# EAGLE design WeatherBoard (EAGLE 9.6.2)
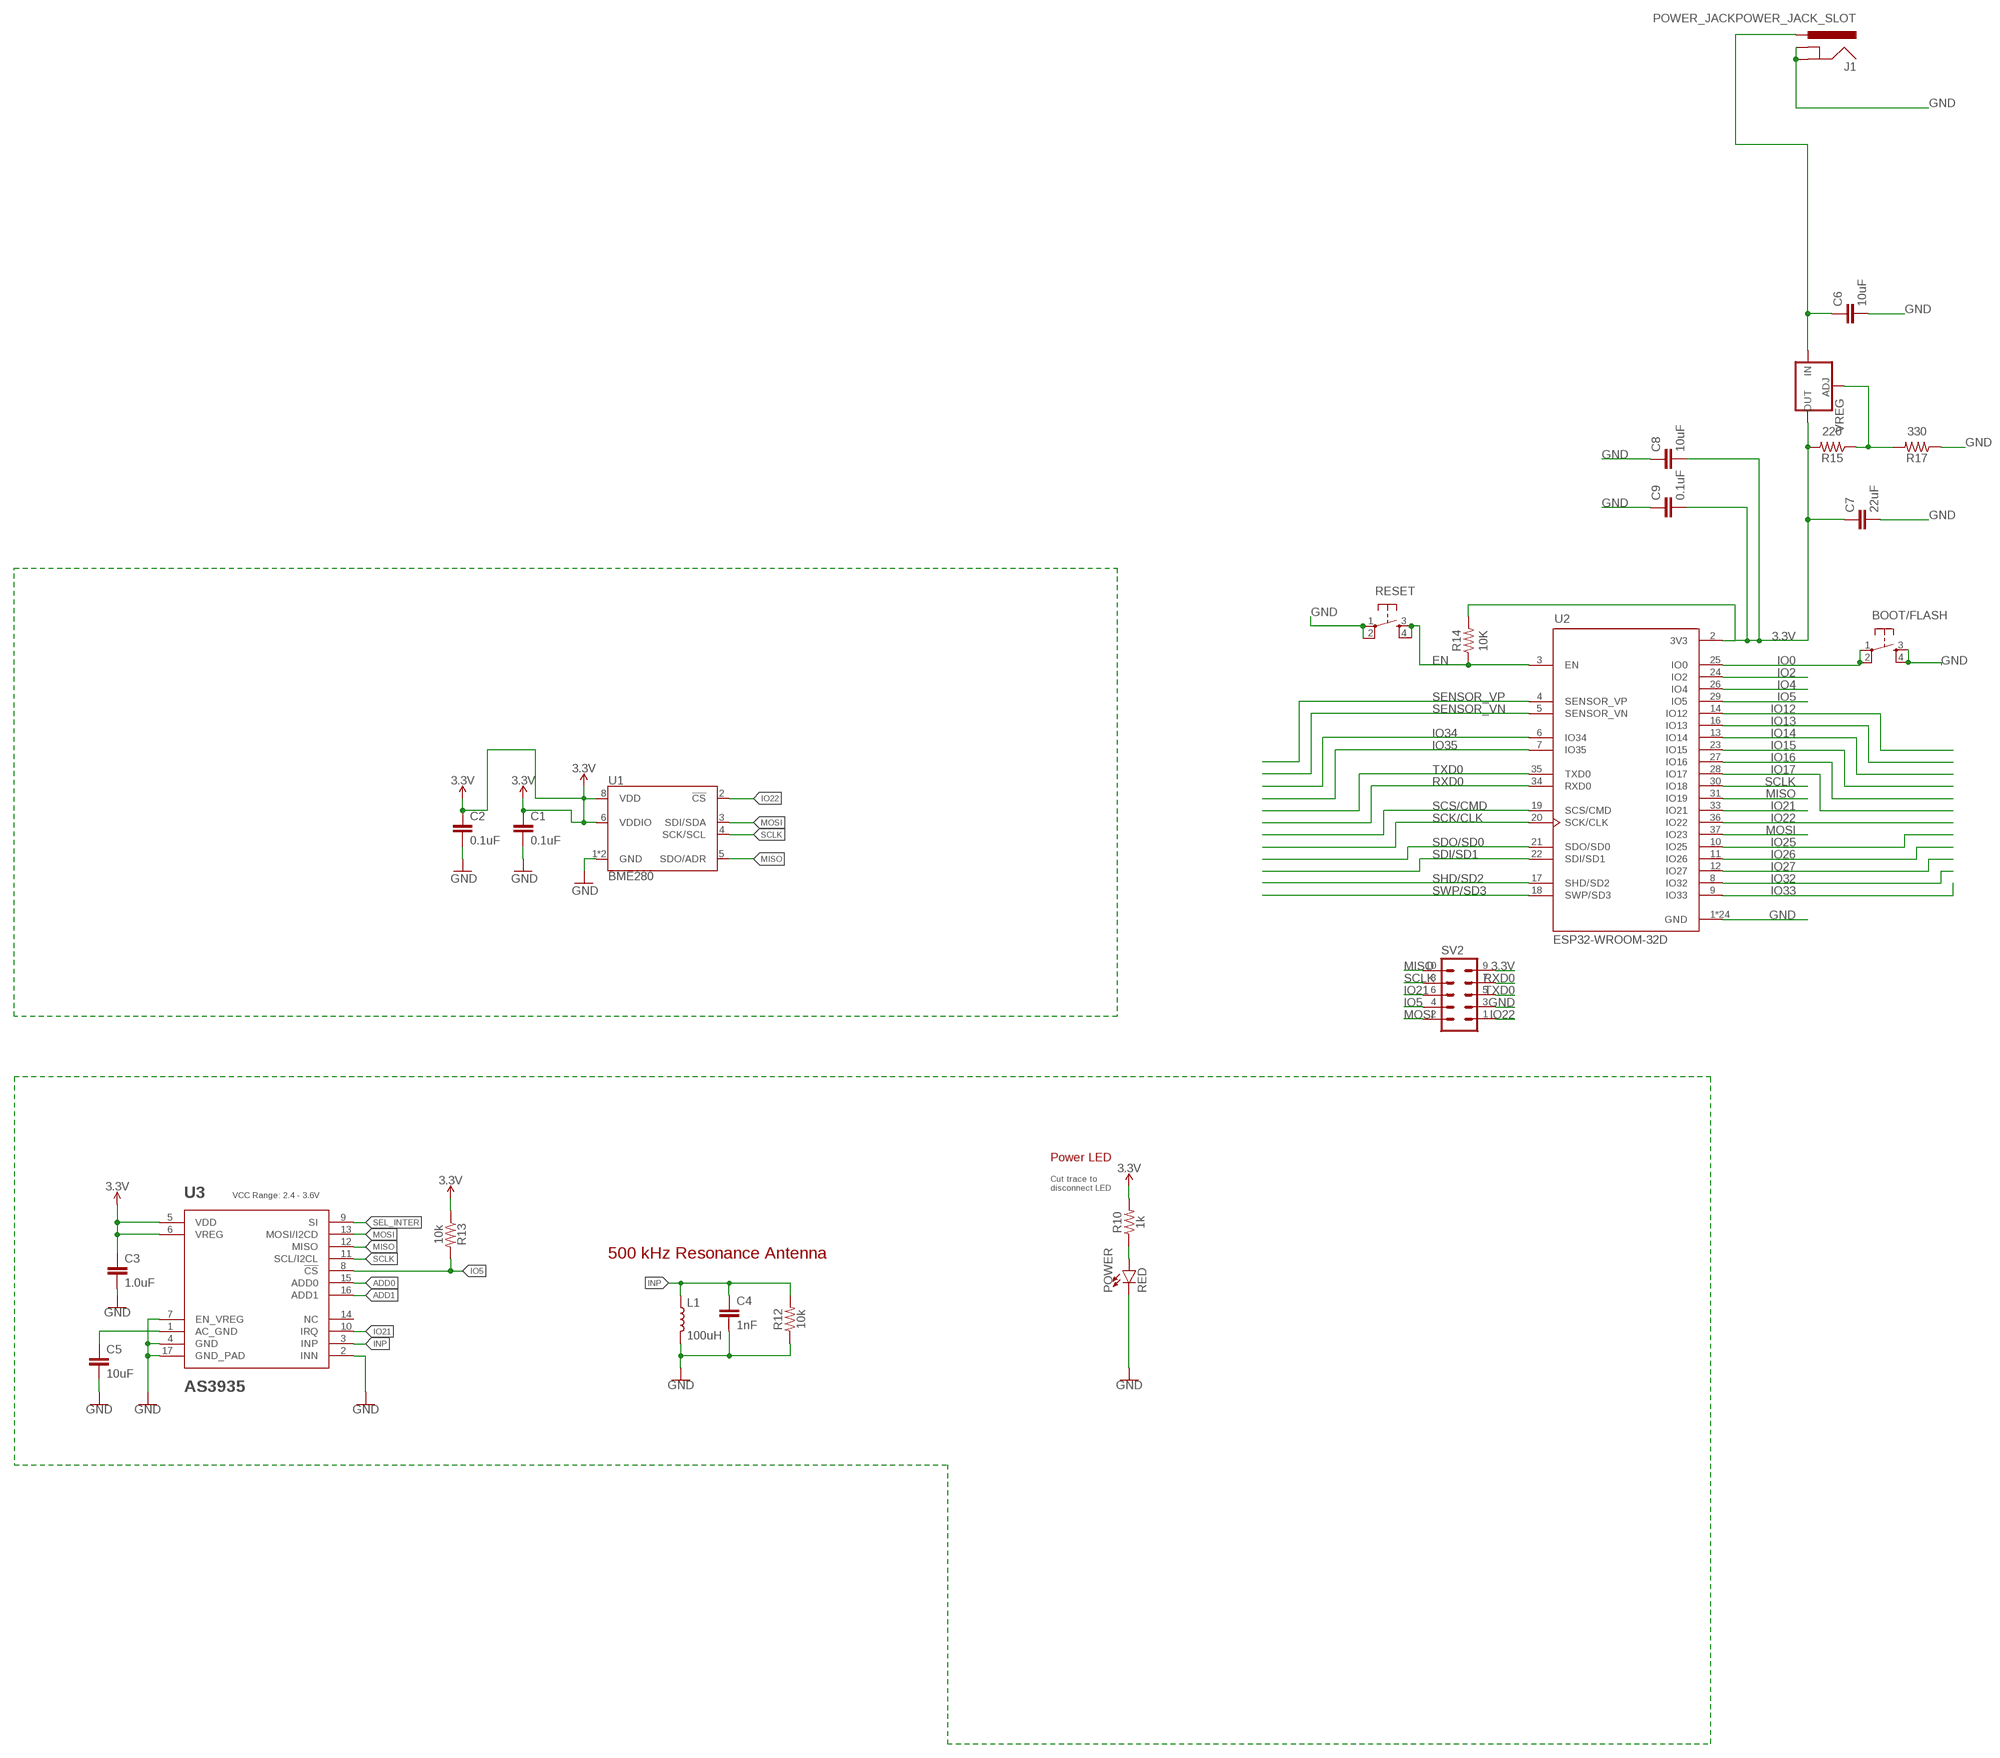
[diagram p0: schematic, sheet 1]

## Parts
BOOT/FLASH  TAC_SWITCHPTH  [TACTILE-PTH]
C1  0.1uF  0.1UF-0603-25V-(+80/-20%)  [0603]
C2  0.1uF  0.1UF-0603-25V-(+80/-20%)  [0603]
C3  1.0uF  1.0UF-0603-16V-10%  [0603]
C4  1nF  1.0NF/1000PF-0603-50V-10%  [0603]
C5  10uF  10UF-0603-6.3V-20%  [0603]
C6  10uF  10UF-0603-6.3V-20%  [0603]
C7  22uF  22NF/22,000PF-0603-50V-10%  [0603]
C8  10uF  10UF-0603-6.3V-20%  [0603]
C9  0.1uF  0.1UF-0603-25V-(+80/-20%)  [0603]
J1  POWER_JACKPOWER_JACK_SLOT  [POWER_JACK_PTH_SLOT]
L1  100uH  MA5532-AE  [MA5532-AE]
POWER  RED  LED-RED0603  [LED-0603]
R10  1k  1KOHM-0603-1/10W-1%  [0603]
R12  10k  10KOHM-0603-1/10W-1%  [0603]
R13  10k  10KOHM-0603-1/10W-1%  [0603]
R14  10K  1.8MOHM  [0603]
R15  220  1.8MOHM  [0603]
R17  330  1.8MOHM  [0603]
RESET  TAC_SWITCHPTH  [TACTILE-PTH]
SV2  MA05-2  [MA05-2]
U1  BME280  [LGA-8-2.5X2.5]
U2  ESP32-WROOM-32D  [MODULE_ESP32-WROOM-32D]
U3  AS3935  AS3935QFN  [16LD_MLPQ]
VREG  ADJWEATHERSTATION  [VREG_NCP1117STAT3G]

## Nets
3.3V: C1.1 C2.1 C3.1 C7.1 C8.2 C9.2 R10.2 R13.1 R14.2 R15.2 SV2.9 U1.6(VDDIO) U1.8(VDD) U2.2(3V3) U3.5(VDD) U3.6(VREG) VREG.2(OUT) VREG.4(OUT)
ADD0: U3.15(ADD0)
ADD1: U3.16(ADD1)
EN: R14.1 RESET.3 RESET.4 U2.3(EN)
GND: BOOT/FLASH.3 BOOT/FLASH.4 C1.2 C2.2 C3.2 C4.2 C5.2 C6.2 C7.2 C8.1 C9.1 J1.GND J1.GNDBREAK L1.2 POWER.C R12.1 R17.1 RESET.1 RESET.2 SV2.3 U1.1(GND) U1.7(GND) U2.1(GND) U2.15(GND) U2.38(GND) U2.39_1(GND) U2.39_2(GND) U2.39_3(GND) U2.39_4(GND) U2.39_5(GND) U2.39_6(GND) U2.39_7(GND) U2.39_8(GND) U2.39_9(GND) U2.39_10(GND) U2.39_11(GND) U2.39_12(GND) U2.39_13(GND) U2.39_14(GND) U2.39_15(GND) U2.39_16(GND) U2.39_17(GND) U2.39_18(GND) U2.39_19(GND) U2.39_20(GND) U2.39_21(GND) U3.2(INN) U3.4(GND) U3.7(EN_VREG) U3.17(GND_PAD)
INP: C4.1 L1.1 R12.2 U3.3(INP)
IO0: BOOT/FLASH.1 BOOT/FLASH.2 U2.25(IO0)
IO2: U2.24(IO2)
IO4: U2.26(IO4)
IO5: R13.2 SV2.4 U2.29(IO5) U3.8(!CS)
IO12: U2.14(IO12)
IO13: U2.16(IO13)
IO14: U2.13(IO14)
IO15: U2.23(IO15)
IO16: U2.27(IO16)
IO17: U2.28(IO17)
IO21: SV2.6 U2.33(IO21) U3.10(IRQ)
IO22: SV2.1 U1.2(!CS) U2.36(IO22)
IO25: U2.10(IO25)
IO26: U2.11(IO26)
IO27: U2.12(IO27)
IO32: U2.8(IO32)
IO33: U2.9(IO33)
IO34: U2.6(IO34)
IO35: U2.7(IO35)
MISO: SV2.10 U1.5(SDO/ADR) U2.31(IO19) U3.12(MISO)
MOSI: SV2.2 U1.3(SDI/SDA) U2.37(IO23) U3.13(MOSI/I2CD)
N$1: C5.1 U3.1(AC_GND)
N$7: POWER.A R10.1
N$13: R15.1 R17.2 VREG.1(ADJ)
N$15: C6.1 J1.PWR VREG.3(IN)
RXD0: SV2.7 U2.34(RXD0)
SCK/CLK: U2.20(SCK/CLK)
SCLK: SV2.8 U1.4(SCK/SCL) U2.30(IO18) U3.11(SCL/I2CL)
SCS/CMD: U2.19(SCS/CMD)
SDI/SD1: U2.22(SDI/SD1)
SDO/SD0: U2.21(SDO/SD0)
SEL_INTER: U3.9(SI)
SENSOR_VN: U2.5(SENSOR_VN)
SENSOR_VP: U2.4(SENSOR_VP)
SHD/SD2: U2.17(SHD/SD2)
SWP/SD3: U2.18(SWP/SD3)
TXD0: SV2.5 U2.35(TXD0)
Unconnected: U3.14(NC)

## Notes on the sheet
- Power LED
- Cut trace to 
  disconnect LED
- VCC Range: 2.4 - 3.6V
- 500 kHz Resonance Antenna

## Library data of the parts
BOOT/FLASH RESET = SparkFun-Retired:TAC_SWITCH: Momentary Switch Button commonly used for reset or general input. Spark Fun Electronics SKU : COM-00097 SMT- SWCH-08247
C1 C2 C9 = SparkFun-Capacitors:0.1UF: 0.1µF ceramic capacitors A capacitor is a passive two-terminal electrical component used to store electrical energy temporarily in an electric field.; PROD_ID: CAP-00810
C3 = SparkFun-Capacitors:1.0UF: 1µF ceramic capacitors A capacitor is a passive two-terminal electrical component used to store electrical energy temporarily in an electric field.; PROD_ID: CAP-00868
C4 = SparkFun-Capacitors:1.0NF/1000PF: 1nF/1,000pF ceramic capacitors A capacitor is a passive two-terminal electrical component used to store electrical energy temporarily in an electric field.; PROD_ID: CAP-07886
C5 C6 C8 = SparkFun-Capacitors:10UF: 10.0µF ceramic capacitors A capacitor is a passive two-terminal electrical component used to store electrical energy temporarily in an electric field.; PROD_ID: CAP-11015
C7 = SparkFun-Capacitors:22NF/22,000PF: 0.022uF/22nF/22,000pF ceramic capacitors A capacitor is a passive two-terminal electrical component used to store electrical energy temporarily in an electric field.; PROD_ID: CAP-07885; VALUE: 22nF
J1 = SparkFun-Connectors:POWER_JACK: Power Jack Connector This is the standard 5.5mm barrel jack for power. The PTH is the most common, proven, reliable, footprint. The Slot footprint only works if the mill layer is transmitted to the PCB fab house so be warned. Here are the connectors we sell at SparkFun: DC Barrel Power Jack/Connector <https://www.sparkfun.com/products/119> (PRT-00119) DC Barrel Power Jack/Connector (SMD) <https://www.sparkfun.com/products/12748> (PRT-12748) DC Barrel Jack Adapter - Breadboard Compatible <https://www.sparkfun.com/products/10811> (PRT-10811) It is used on this SparkFun product (and many, many others): SparkFun RedBoard - Programmed with Arduino <https://www.sparkfun.com/products/12757> (DEV-12757) Also, if you need a mating power supply or connector, please check these out: Wall Adapter Power Supply - 9VDC 650mA <https://www.sparkfun.com/products/298> (TOL-00298) DC Barrel Jack Adapter - Male <https://www.sparkfun.com/products/10287> (PRT-10287); PROD_ID: CONN-08197
L1 = SparkFun-Coils:MA5532-AE: RFID Transponder Coil - MA5532-AE; PROD_ID: NDUC-11334
POWER = SparkFun-LED:LED-RED: Red SMD LED Used in manufacturing of most products at SparkFun Packages: 0603 - SMD 0603 package [Product Link] <http://docs.avagotech.com/docs/AV02-0551EN> 0603 SMART - SMD 0603 SMART package ( more efficient and expensive)[Product Link] <http://www.osram-os.com/Graphics/XPic2/00077099_0.pdf> 1206 - SMD1206 package [Product Link] <https://www.sparkfun.com/datasheets/DevTools/LilyPad/Q150OVS4.pdff> SparkFun Products: Pro Mini 328 -5V <https://www.sparkfun.com/products/821> RedBoard <https://www.sparkfun.com/products/12757> IOIO-OTG <https://www.sparkfun.com/products/13613>; PROD_ID: DIO-00819
R10 = SparkFun-Resistors:1KOHM: 1kΩ resistor A resistor is a passive two-terminal electrical component that implements electrical resistance as a circuit element. Resistors act to reduce current flow, and, at the same time, act to lower voltage levels within circuits. - Wikipedia; PROD_ID: RES-07856
R12 R13 = SparkFun-Resistors:10KOHM: 10kΩ resistor A resistor is a passive two-terminal electrical component that implements electrical resistance as a circuit element. Resistors act to reduce current flow, and, at the same time, act to lower voltage levels within circuits. - Wikipedia; PROD_ID: RES-00824
R14 R15 R17 = SparkFun-Resistors:1.8MOHM: 1.8 MOhms ±5% 0.1W, 1/10W Chip Resistor 0603; PROD_ID: RES-13994; VALUE: 1.8M
SV2 = con-lstb:MA05-2: PIN HEADER; OC_FARNELL: unknown; OC_NEWARK: unknown
U1 = SparkFun-Sensors:BME280: Bosch BME280 – Combined Humidity and Pressure Sensor The BME280 is as combined digital humidity, pressure and temperature sensor based on proven sensing principles. The sensor module is housed in an extremely compact metal-lid LGA package with a footprint of only 2.5×2.5mm² with a height of 0.93mm. Its small dimensions and its low power consumption allow the implementation in battery driven devices such as handsets, GPS modules or watches. Datasheet <https://cdn.sparkfun.com/assets/learn_tutorials/4/1/9/BST-BME280_DS001-10.pdf> SparkFun Products SparkFun Atmospheric Sensor Breakout - BME280 <https://www.sparkfun.com/products/13676> (SEN-13676); PROD_ID: IC-13090
U2 = ESP32-WROOM-32D:ESP32-WROOM-32D: Bluetooth, WiFi 802.11b/g/n, Bluetooth v4.2 + EDR, Class 1, 2 and 3 Transceiver Module 2.4GHz ~ 2.5GHz Integrated, Trace Surface Mount Check availability <https://pricing.snapeda.com/parts/ESP32-WROOM-32D/Espressif%20Systems/view-part?ref=eda>; AVAILABILITY: In Stock; DESCRIPTION: Bluetooth, WiFi 802.11b/g/n, Bluetooth v4.2 +EDR, Class 1, 2 and 3 Transceiver Module 2.4GHz ~ 2.5GHz Integrated; MF: Espressif Systems; MP: ESP32-WROOM-32D; PACKAGE: Module Espressif Systems; PRICE: None; PURCHASE-URL: https://pricing.snapeda.com/search/part/ESP32-WROOM-32D/?ref=eda
U3 = SparkFun-Sensors:AS3935: AS3935 Franklin Lightning Sensor The AS3935 is a programmable fully integrated Lightning Sensor IC that detects the presence and approach of potentially hazardous lightning activity in the vicinity and provides an estimation on the distance to the head of the storm. The embedded lightning algorithm checks the incoming signal pattern to reject the potential man-made disturbers.The AS3935 can also provide information on the noise level and inform the external unit (e.g. microcontroller) in case of high noise conditions, with the noise floor generator and noise floor evaluation blocks.; PROD_ID: IC-11333
VREG = VREG_NCP1117STAT3G:ADJWEATHERSTATION

## Board
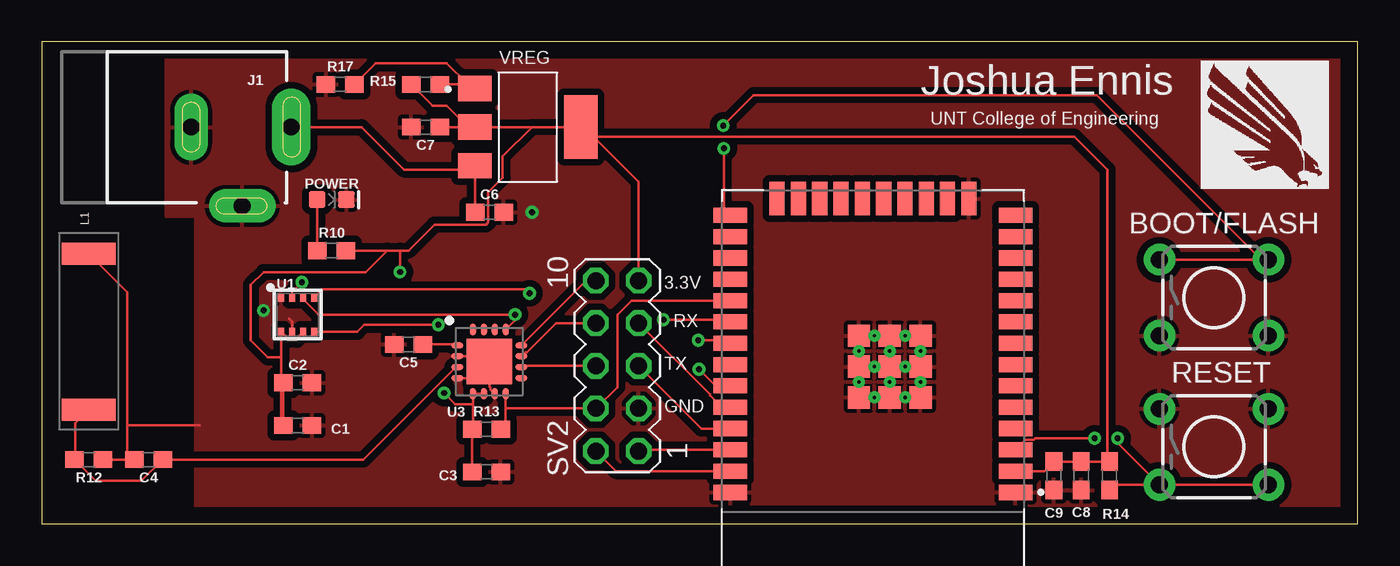
[diagram p1: board, top side]
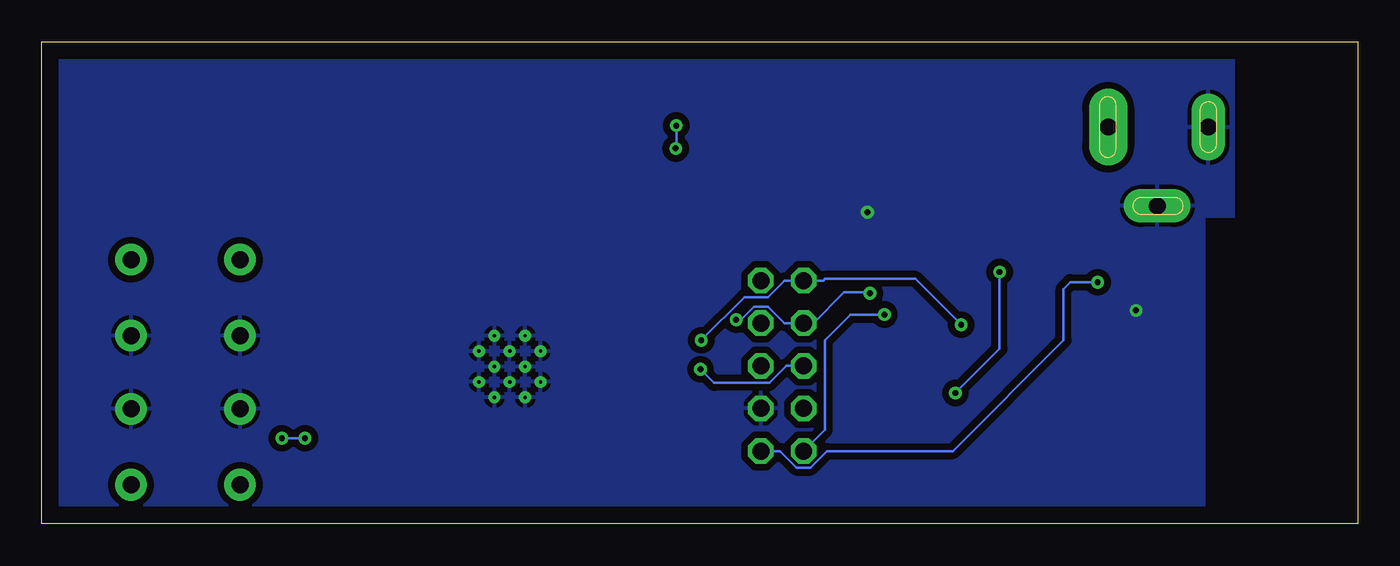
[diagram p2: board, bottom side, seen from below]

Size 78.41 x 28.69 mm. Coordinates in mm from the lower left corner, seen from the top.
Outline: 0,0 78.41,0 78.41,28.69 0,28.69 0,0
Copper layers (1*16): Top 0.035mm / dielectric 1.5mm / Bottom 0.035mm
Design rules "default": minimum track width 6mil, minimum drill 0.35mm, track to track 6mil, track to pad 6mil, pad to pad 6mil, via to via 6mil, smd to smd 6mil, copper to edge 40mil, drill to drill 6mil, minimum pad ring 10mil, minimum via ring 8mil, stop-mask expansion 4mil, vias tented up to drill 0mil, thermal gap 10mil

### Footprints (pad centres in the part's own frame; a part is rotated, then mirrored left to right if it is on the bottom)
TACTILE-PTH = drill 1.016 pad 1.88: 1 -3.251,2.261; 2 3.251,2.261; 3 -3.251,-2.261; 4 3.251,-2.261
0603 = smd 1.1 x 1: 1 -0.85,0; 2 0.85,0
POWER_JACK_PTH_SLOT = drill 1 pad 2 long: GND 0,0; GNDBREAK -3.048,4.699 | drill 1 pad 2.3 long: PWR -5.969,0
MA5532-AE = smd 1.3 x 3.2: 1 -4.65,0; 2 4.65,0
LED-0603 = smd 1 x 1: A -0.877,0; C 0.877,0
MA05-2 = drill 1.016 octagon: 1 -5.08,-1.27; 2 -5.08,1.27; 3 -2.54,-1.27; 4 -2.54,1.27; 5 0,-1.27; 6 0,1.27; 7 2.54,-1.27; 8 2.54,1.27; 9 5.08,-1.27; 10 5.08,1.27
LGA-8-2.5X2.5 = smd 0.35 x 0.5: 1 -0.975,1.025; 2 -0.325,1.025; 3 0.325,1.025; 4 0.975,1.025; 5 0.975,-1.025; 6 0.325,-1.025; 7 -0.325,-1.025; 8 -0.975,-1.025
MODULE_ESP32-WROOM-32D = smd 2 x 0.9: 1 -8.5,5.26; 2 -8.5,3.99; 3 -8.5,2.72; 4 -8.5,1.45; 5 -8.5,0.18; 6 -8.5,-1.09; 7 -8.5,-2.36; 8 -8.5,-3.63; 9 -8.5,-4.9; 10 -8.5,-6.17; 11 -8.5,-7.44; 12 -8.5,-8.71; 13 -8.5,-9.98; 14 -8.5,-11.25; 25 8.5,-11.25; 26 8.5,-9.98; 27 8.5,-8.71; 28 8.5,-7.44; 29 8.5,-6.17; 30 8.5,-4.9; 31 8.5,-3.63; 32 8.5,-2.36; 33 8.5,-1.09; 34 8.5,0.18; 35 8.5,1.45; 36 8.5,2.72; 37 8.5,3.99; 38 8.5,5.26 | smd 0.9 x 2: 15 -5.715,-12.25; 16 -4.445,-12.25; 17 -3.175,-12.25; 18 -1.905,-12.25; 19 -0.635,-12.25; 20 0.635,-12.25; 21 1.905,-12.25; 22 3.175,-12.25; 23 4.445,-12.25; 24 5.715,-12.25 | smd 1.33 x 1.33: 39_1 -2.835,-0.405; 39_2 -1,-0.405; 39_3 0.835,-0.405; 39_4 -2.835,-2.24; 39_5 -1,-2.24; 39_6 0.835,-2.24; 39_7 -2.835,-4.075; 39_8 -1,-4.075; 39_9 0.835,-4.075 | drill 0.2 pad 0.3: 39_10 -1.917,-0.405; 39_11 -0.083,-0.405; 39_12 -2.835,-1.323; 39_13 -1,-1.323; 39_14 0.835,-1.323; 39_15 -1.917,-2.24; 39_16 -0.083,-2.24; 39_17 -2.835,-3.158; 39_18 -1,-3.158; 39_19 0.835,-3.158; 39_20 -1.917,-4.075; 39_21 -0.083,-4.075
16LD_MLPQ = smd 0.7 x 0.35: 1 -1.919,0.968; 2 -1.919,0.318; 3 -1.919,-0.332; 4 -1.919,-0.982; 9 1.908,-0.982; 10 1.908,-0.332; 11 1.908,0.318; 12 1.908,0.968 | smd 0.35 x 0.7: 5 -0.982,-1.917; 6 -0.332,-1.917; 7 0.318,-1.917; 8 0.968,-1.917; 13 0.968,1.907; 14 0.318,1.907; 15 -0.332,1.907; 16 -0.982,1.907 | smd 2.7 x 2.7: 17 -0.007,-0.007
VREG_NCP1117STAT3G = smd 2 x 1.5: 1 -3.15,2.3; 2 -3.15,0; 3 -3.15,-2.3 | smd 2 x 3.8: 4 3.15,0

### Placement (x,y rotation side)
BOOT/FLASH  69.85,13.46 0 top
C1  15.24,5.84 0 top
C2  15.24,8.38 0 top
C3  26.49,3.07 0 top
C4  6.35,3.81 180 top
C5  21.84,10.67 180 top
C6  26.67,18.54 0 top
C7  22.86,23.62 180 top
C8  61.94,2.84 90 top
C9  60.31,2.84 90 top
J1  8.89,23.62 180 top
L1  2.79,11.43 90 top
POWER  17.27,19.3 0 top
R10  17.27,16.26 0 top
R12  2.79,3.81 180 top
R13  26.49,5.61 0 top
R14  63.63,2.84 90 top
R15  22.86,26.16 180 top
R17  17.78,26.16 0 top
RESET  69.85,4.57 0 top
SV2  34.29,9.4 90 top
U1  15.24,12.45 0 top
U2  49.53,7.11 180 top
U3  26.67,9.65 0 top
VREG  28.96,23.62 0 top

### Tracks (layer width: path | path; a pad name or v marks a point on that pad's centre or on a via)
3.3V  (via drill 0.35)
  Top 0.152: R15.2 23.28,24.89 24.13,24.89 25.4,23.62 | R10.2 20.57,16.26 | 20.57,16.26 21.34,16.26 | 21.34,16.26 21.84,16.26 23.4,17.81 26.46,17.81 26.6,17.95 26.6,19.75 27.46,20.61 27.46,21.87 29.21,23.62 | U2.2 59.74,3.12 C9.2 C8.2 R14.2 63.5,3.82 63.5,21.08 61.53,23.05 32.58,23.05 32,23.62 | 25.69,7.11 U3.5 U3.6 | 25.69,7.11 25.69,5.66 R13.1 C3.1 | SV2.9 35.56,20.37 32.31,23.62 VREG.4 32,23.62 | 14.26,9.91 U1.8 14.51,11.17 14.51,11.08 14.64,10.94 15.18,10.94 15.32,11.08 15.32,11.17 U1.6 | 14.26,9.91 14.26,5.97 C1.1 C2.1 | 20.57,16.26 19.3,14.99 13.21,14.99 12.45,14.22 12.45,10.92 13.46,9.91 14.26,9.91 | 25.69,7.11 24.64,7.11 v23.97,7.78 | v21.34,14.99 21.34,16.26 | 25.4,23.62 C7.1 | 25.4,23.62 VREG.2 29.21,23.62 | 32,23.62 29.21,23.62
  Bottom 0.152: v21.34,14.99 21.34,10.41 v23.97,7.78
EN  (via drill 0.35)
  Top 0.152: RESET.3 RESET.4 | U2.3 58.62,4.98 59.12,4.98 59.22,5.08 v62.74,5.08 | v64.11,5.08 64.11,4.8 RESET.3 | R14.1 63.94,2.31 RESET.3
  Bottom 0.152: v62.74,5.08 v64.11,5.08
GND  (via drill 0.35)
  Top 0.152: L1.2 5.08,13.79 5.08,5.84 | 26.92,7.8 U3.7 26.74,7.98 26.74,8.08 26.67,8.15 U3.17 | U1.7 14.91,12.01 14.73,12.19 | 24.82,9.91 U3.2 26.34,9.97 U3.17 | U3.17 | U3.17 26.86,9.65 | U3.4 25.7,8.67 U3.17 | R12.1 C4.2 5.08,4.23 5.08,5.84 | 5.08,5.84 9.4,5.84
  other vias: 13.21,12.7 29.21,18.54
  pour Top (isolate 0.406): 7.37,29.97 78.74,29.97 78.74,-1.27 9.14,-1.27 9.14,18.29 7.37,18.29
  pour Bottom (isolate 0.406): 7.37,18.29 7.37,29.97 78.74,29.97 78.74,-1.27 9.14,-1.27 9.14,18.29
INP
  Top 0.152: R12.2 1.99,3.77 | 1.99,3.77 3.21,2.54 5.93,2.54 C4.1 19.14,3.81 24.66,9.32 U3.3 | L1.1 1.99,5.97 1.99,3.77
IO0  (via drill 0.35)
  Top 0.152: v40.6,23.71 42.42,25.53 62.87,25.53 72.39,16 72.11,15.72 BOOT/FLASH.1 BOOT/FLASH.2 | U2.25 40.64,18.75 v40.64,22.35
  Bottom 0.152: v40.6,23.71 40.6,22.39 v40.64,22.35
IO5
  Top 0.152: U2.29 35.13,13.28 34.29,12.45 34.29,8.13 SV2.4 27.64,6.86 | U3.8 27.64,6.86 | 27.64,6.86 27.64,5.91 R13.2
IO21  (via drill 0.35)
  Top 0.152: SV2.6 28.66,9.4 U3.10 | v39.16,9.19 40.15,8.2 U2.33
  Bottom 0.152: SV2.6 34.04,9.4 35.05,8.38 38.35,8.38 v39.16,9.19
IO22  (via drill 0.35)
  Top 0.152: U2.36 35.63,4.39 SV2.1 | U1.2 14.91,13.8 v15.49,14.38
  Bottom 0.152: SV2.1 34.42,4.32 33.43,3.33 32.61,3.33 31.62,4.32 24.13,4.32 17.53,10.92 17.53,13.97 17.12,14.38 v15.49,14.38
MISO  (via drill 0.35)
  Top 0.152: U3.12 32.44,14.48 SV2.10 | v39.12,10.92 40.85,10.92 U2.31 | U1.5 18.79,11.42 19.2,11.84 v23.62,11.84
  Bottom 0.152: v39.12,10.92 36.55,13.49 35.15,13.49 34.16,14.48 SV2.10 31.85,14.48 31.75,14.58 26.36,14.58 v23.62,11.84
MOSI  (via drill 0.35)
  Top 0.152: SV2.2 34.22,3.12 U2.37 | U3.13 28.19,12.12 v28.19,12.45 16.49,12.45 15.56,13.37 U1.3
  Bottom 0.152: SV2.2 31.75,5.59 31.75,10.92 30.23,12.45 v28.19,12.45
N$1
  Top 0.152: C5.1 24.7,10.67 U3.1
N$7
  Top 0.152: POWER.A 16.39,16.28 R10.1
N$13
  Top 0.152: R15.1 24.64,26.16 25.4,26.16 | 25.4,26.16 25.88,26.16 25.81,26.09 VREG.1 25.57,26.16 25.4,26.16 | R17.2 19.9,27.43 24.13,27.43 25.4,26.16
N$15
  Top 0.152: J1.PWR 19.05,23.62 21.59,21.08 24.64,21.08 25.4,21.08 | 25.4,21.08 25.82,20.66 C6.1 | 25.4,21.08 25.57,21.08 VREG.3
RXD0
  Top 0.152: SV2.7 39.8,7.7 39.8,7.66 40.53,6.93 U2.34
SCLK  (via drill 0.35)
  Top 0.152: U3.11 28.82,10.22 28.92,10.22 30.64,11.94 SV2.8 | U1.4 16.71,13.97 28.81,13.97 v29.06,13.72 | U2.30 40.9,12.14 v37.04,12.14
  Bottom 0.152: v37.04,12.14 36.76,12.14 35.97,12.93 35.15,12.93 34.16,11.94 SV2.8 32.44,11.94 30.61,13.77 29.11,13.77 v29.06,13.72
TXD0
  Top 0.152: U2.35 39.3,5.66 SV2.5

### Text on the board
tPlace: Joshua Ennis | UNT College of Engineering | 3.3V | RX | TX | GND